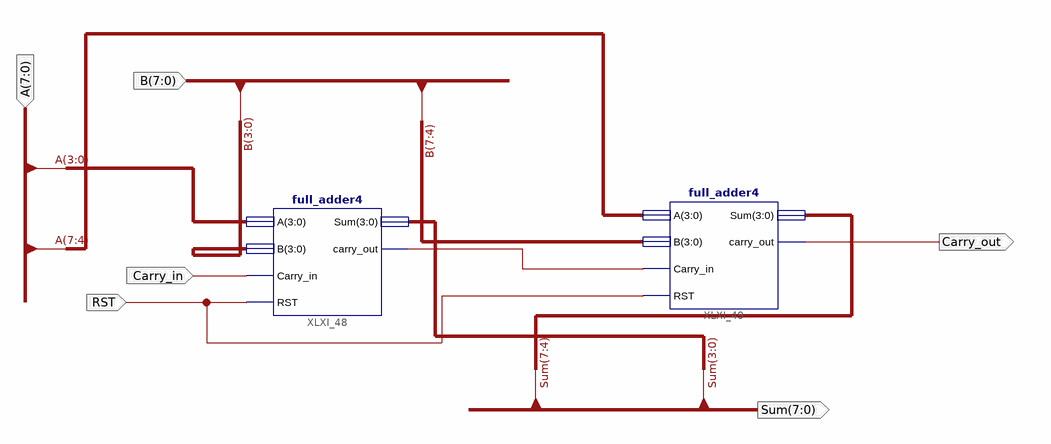
[diagram p0: schematic sheet 1]
// Xilinx ISE schematic full_adder8.sch (artix7) as structural Verilog: 2 symbols, 6 ports
module full_adder8 (
  input  Carry_in,
  input  RST,
  input  [7:0] A,
  input  [7:0] B,
  output Carry_out,
  output [7:0] Sum
);

  wire XLXN_105;

  full_adder4 XLXI_48 (.A(A[3:0]), .B(B[3:0]), .Carry_in(Carry_in), .carry_out(XLXN_105), .RST(RST), .Sum(Sum[3:0]));
  full_adder4 XLXI_49 (.A(A[7:4]), .B(B[7:4]), .Carry_in(XLXN_105), .carry_out(Carry_out), .RST(RST), .Sum(Sum[7:4]));
endmodule
